# EAGLE design geiger_fixedR5R6 (EAGLE 5.11)
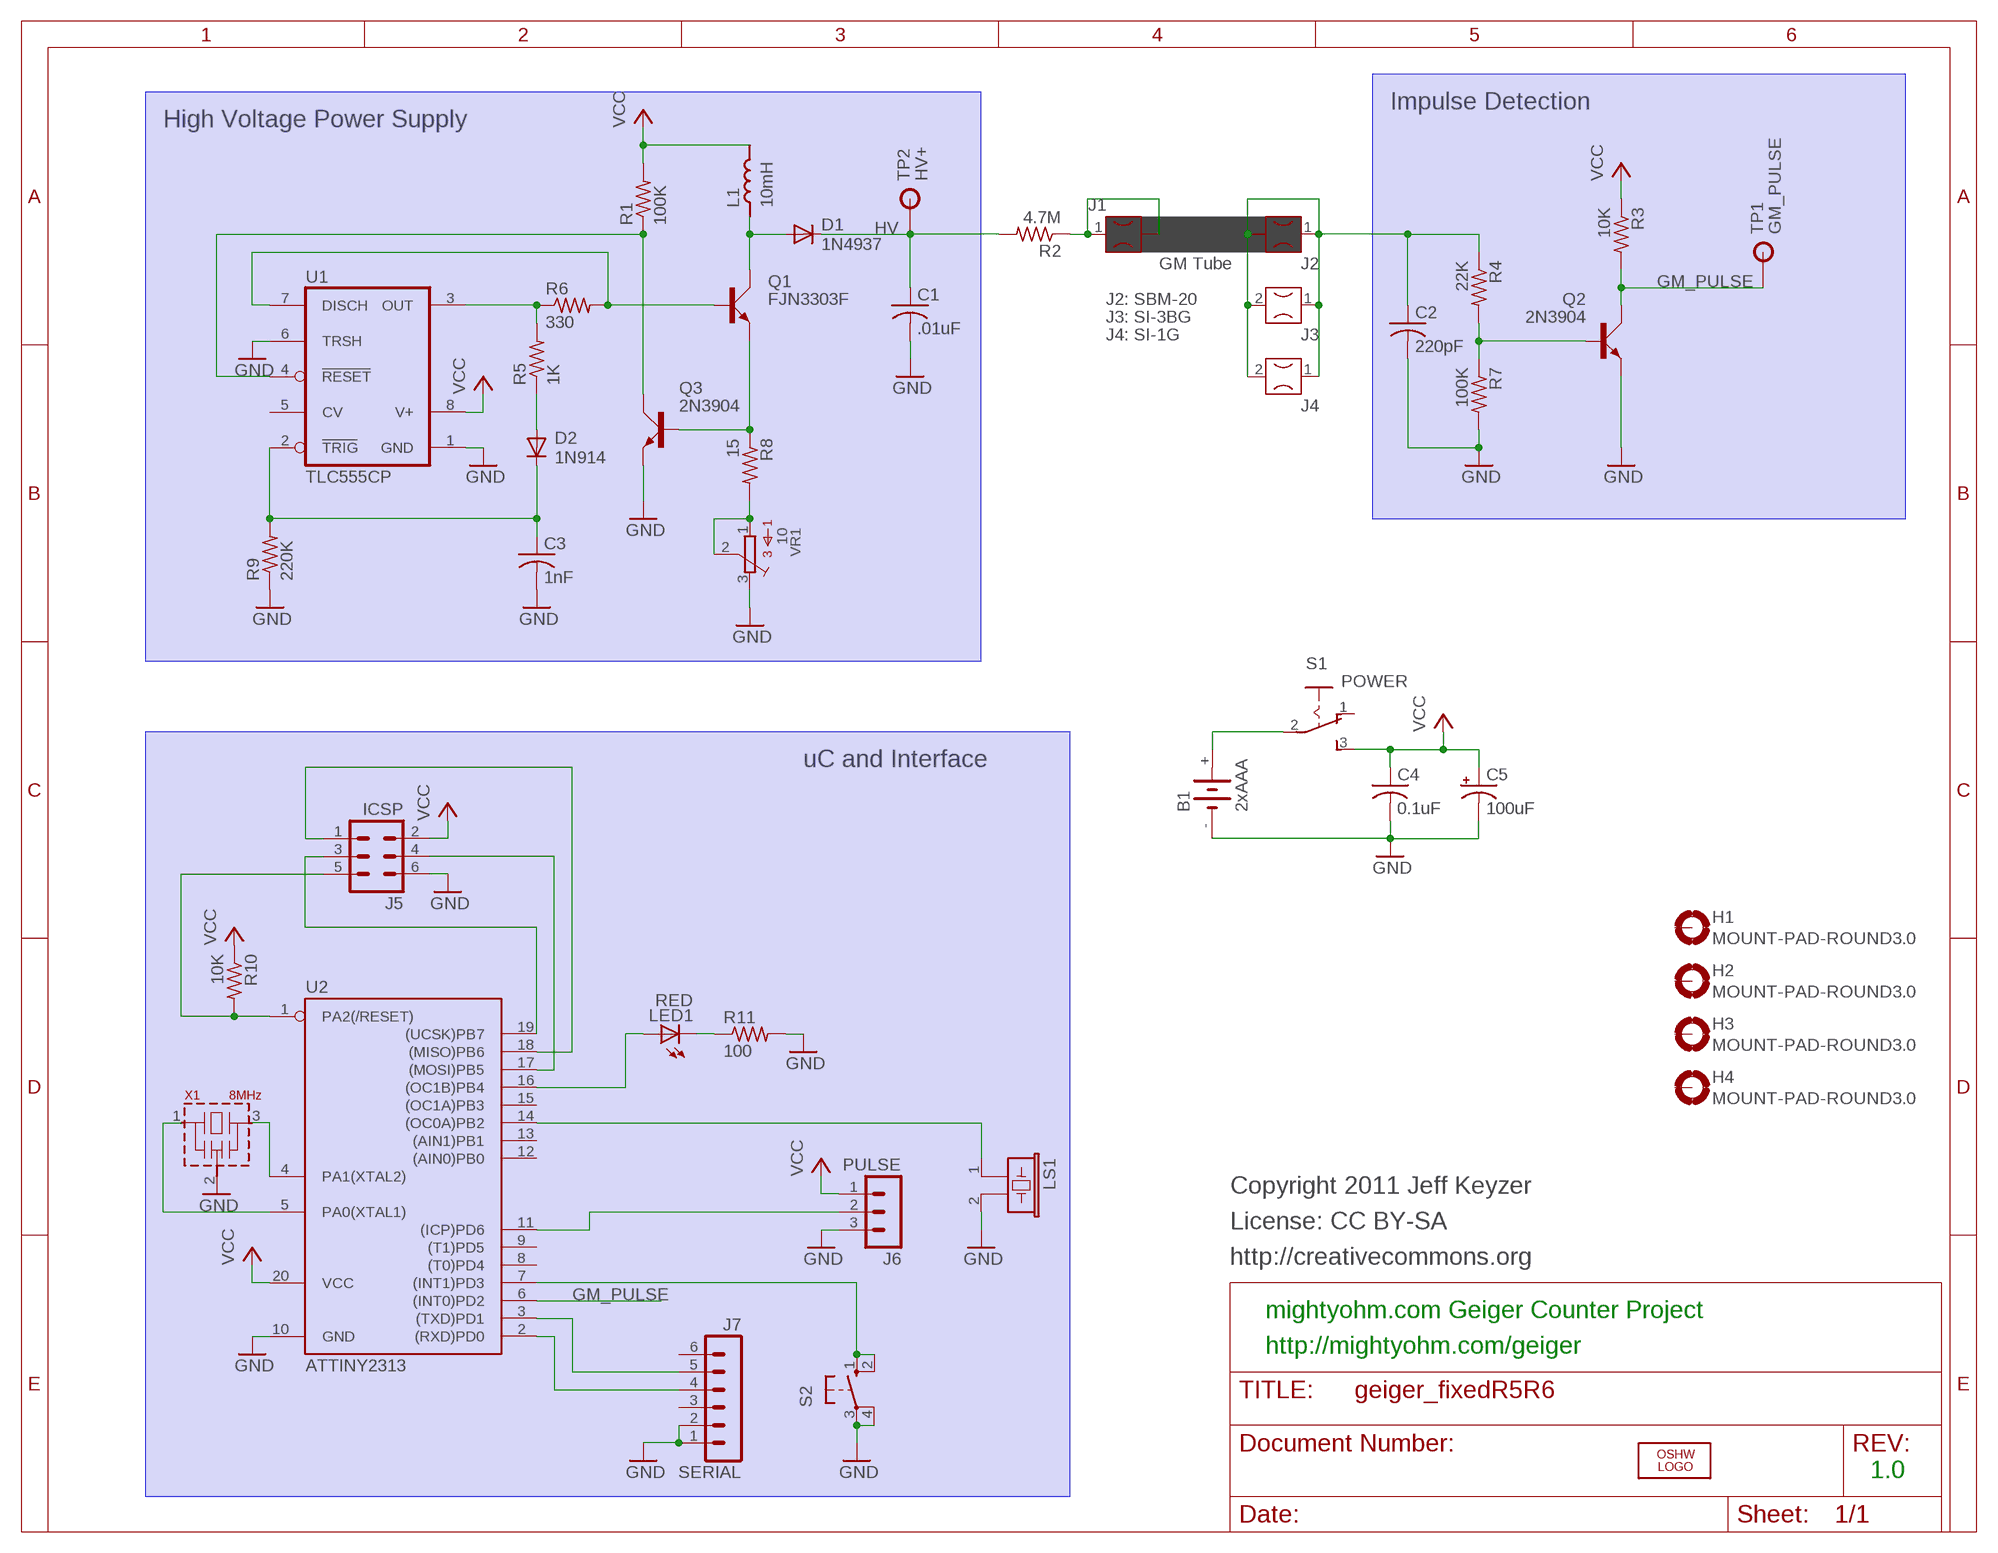
[diagram p0: schematic, sheet 1]

## Parts
B1  2xAAA  BATTERY2XAAA_PCB  [12BH423-GR]
C1  .01uF  C-US102-043X133  [C102-043X133]
C2  220pF  C-US050-030X075  [C050-030X075]
C3  1nF  C-US050-025X075  [C050-025X075]
C4  0.1uF  C-US025-025X050  [C025-025X050]
C5  100uF  CPOL-USE2.5-6  [E2,5-6]
D1  1N4937  1N4933  [DO41-10]
D2  1N914  1N4148DO35-7  [DO35-7]
H1  MOUNT-PAD-ROUND3.0  [3,0-PAD]
H2  MOUNT-PAD-ROUND3.0  [3,0-PAD]
H3  MOUNT-PAD-ROUND3.0  [3,0-PAD]
H4  MOUNT-PAD-ROUND3.0  [3,0-PAD]
J1  FUSECLIPPCMOUNT  [FUSECLIP_PCMOUNT]
J2  FUSECLIPPCMOUNT  [FUSECLIP_PCMOUNT]
J3  FUSECLIPPCMOUNT  [FUSECLIP_PCMOUNT]
J4  FUSECLIPPCMOUNT  [FUSECLIP_PCMOUNT]
J5  ICSP  ICSP-6  [ICSP-6]
J6  PULSE  MA03-1  [MA03-1]
J7  SERIAL  MA06-1  [MA06-1]
L1  10mH  INDELC09D  [ELC09D]
LED1  RED  LED5MM  [LED5MM]
LOGO1  OSHW_LOGO_FILLX0200-NT  [OSHW_FILLX200_NOTEXT]
LS1  PIEZO17MM  [PS1740P02E]
Q1  FJN3303F  2N3704  [TO92C]
Q2  2N3904  [TO92D]
Q3  2N3904  [TO92D]
R1  100K  R-US_0207/10  [0207/10]
R2  4.7M  R-US_0207/10  [0207/10]
R3  10K  R-US_0207/10  [0207/10]
R4  22K  R-US_0207/10  [0207/10]
R5  1K  R-US_0207/10  [0207/10]
R6  330  R-US_0207/10  [0207/10]
R7  100K  R-US_0207/10  [0207/10]
R8  15  R-US_0207/10  [0207/10]
R9  220K  R-US_0207/10  [0207/10]
R10  10K  R-US_0207/10  [0207/10]
R11  100  R-US_0207/10  [0207/10]
S1  POWER  SWITCH_SPDT  [OS102011]
S2  10-XX  [B3F-10XX]
TP1  GM_PULSE  TPPTH  [TP_PTH]
TP2  HV+  TPPTH  [TP_PTH]
U1  TLC555CP  ICM7555  [DIL08]
U2  ATTINY2313  TINY2313-*P*  [DIL20]
VR1  10  3386-P  [3386P]
X1  8MHz  CSTLA_T  [CSTLA_T]

## Nets
GM_PULSE: Q2.C R3.2 TP1.P$1(TP) U2.6((INT0)PD2)
GND: B1.- C1.2 C2.2 C3.2 C4.2 C5.- J5.6 J6.3 J7.1 J7.2 LS1.2 Q2.E Q3.E R7.2 R9.1 R11.2 S2.3(P) S2.4(P1) U1.1(GND) U1.6(TRSH) U2.10(GND) VR1.3 X1.2(VSS)
HV: C1.1 D1.C R2.2 TP2.P$1(TP)
N$1: D2.A R5.1
N$2: S2.1(S) S2.2(S1) U2.7((INT1)PD3)
N$3: Q3.C R1.1 U1.4(RESET)
N$4: LS1.1 U2.14((OC0A)PB2)
N$5: B1.+ S1.2
N$6: J5.4 U2.17((MOSI)PB5)
N$7: J5.3 U2.19((UCSK)PB7)
N$8: Q1.B R6.2 U1.7(DISCH)
N$9: C3.1 D2.C R9.2 U1.2(TRIG)
N$10: R5.2 R6.1 U1.3(OUT)
N$11: Q1.E Q3.B R8.1
N$12: D1.A L1.1 Q1.C
N$13: J5.5 R10.2 U2.1(PA2(/RESET))
N$14: Q2.B R4.2 R7.1
N$15: J1.1 J1.2 R2.1
N$16: J7.4 U2.2((RXD)PD0)
N$17: J7.5 U2.3((TXD)PD1)
N$18: U2.4(PA1(XTAL2)) X1.3
N$19: U2.5(PA0(XTAL1)) X1.1
N$20: J6.2 U2.11((ICP)PD6)
N$21: LED1.K(C) R11.1
N$22: LED1.A U2.16((OC1B)PB4)
N$23: R8.2 VR1.1 VR1.2
N$39: C2.1 J2.1 J2.2 J3.1 J3.2 J4.1 J4.2 R4.1
N$47: J5.1 U2.18((MISO)PB6)
VCC: C4.1 C5.+ J5.2 J6.1 L1.2 R1.2 R3.1 R10.1 S1.3 U1.8(V+) U2.20(VCC)
Unconnected: H1.B3,0(MOUNT) H2.B3,0(MOUNT) H3.B3,0(MOUNT) H4.B3,0(MOUNT) J7.3 J7.6 S1.1 U1.5(CV) U2.8((T0)PD4) U2.9((T1)PD5) U2.12((AIN0)PB0) U2.13((AIN1)PB1) U2.15((OC1A)PB3)

## Notes on the sheet
- Impulse Detection
- High Voltage Power Supply
- GM Tube
- J2: SBM-20
- J3: SI-3BG
- J4: SI-1G
- uC and Interface
- Copyright 2011 Jeff Keyzer
- License: CC BY-SA
- http://creativecommons.org
- mightyohm.com Geiger Counter Project
- http://mightyohm.com/geiger
- 1.0

## Library data of the parts
B1 = mightyohm:BATTERY
C1-C4 = resistor:C-US: CAPACITOR, American symbol
C5 = resistor:CPOL-US: POLARIZED CAPACITOR, American symbol
D1 = diode:1N4933: DIODE fast recovery rectifier, 1A
D2 = diode:1N4148: DIODE high speed (Philips)
H1-H4 = holes:MOUNT-PAD-ROUND: MOUNTING PAD, round
J1-J4 = connectors:FUSECLIP
J5 = connectors:ICSP-6: PIN HEADER
J6 = mightyohm:MA03-1: PIN HEADER; OC_FARNELL: unknown; OC_NEWARK: unknown
J7 = connectors:MA06-1: PIN HEADER
L1 = passives:IND: Inductor
LED1 = mightyohm:LED: MightyOhm Engineering Light Emitting Diodes (LEDs)
LOGO1 = OSHW:OSHW_LOGO_FILL
LS1 = mightyohm:PIEZO; OC_FARNELL: unknown; OC_NEWARK: unknown
Q1 = transistor-small-signal:2N3704: NPN TRANSISTOR
Q2 Q3 = transistor-small-signal:2N3904: NPN TRANSISTOR
R1-R11 = resistor:R-US_: RESISTOR, American symbol
S1 = passives:SWITCH_SPDT
S2 = switch-omron:10-XX: OMRON SWITCH
TP1 TP2 = connectors:TP: Test Point JSK 1/14/11
U1 = maxim:ICM7555: TIMER
U2 = avr-6:TINY2313*: Atmel Tiny2313 2K Flash, 128 bytes EEPROM, 128 bytes RAM
VR1 = BOURNS:3386-: 3386 Series 3/8" Square Trimmer
X1 = murata-resonators:CSTLA_T: Ceramic resonator 10.01 to 13.00 MHz

## Board
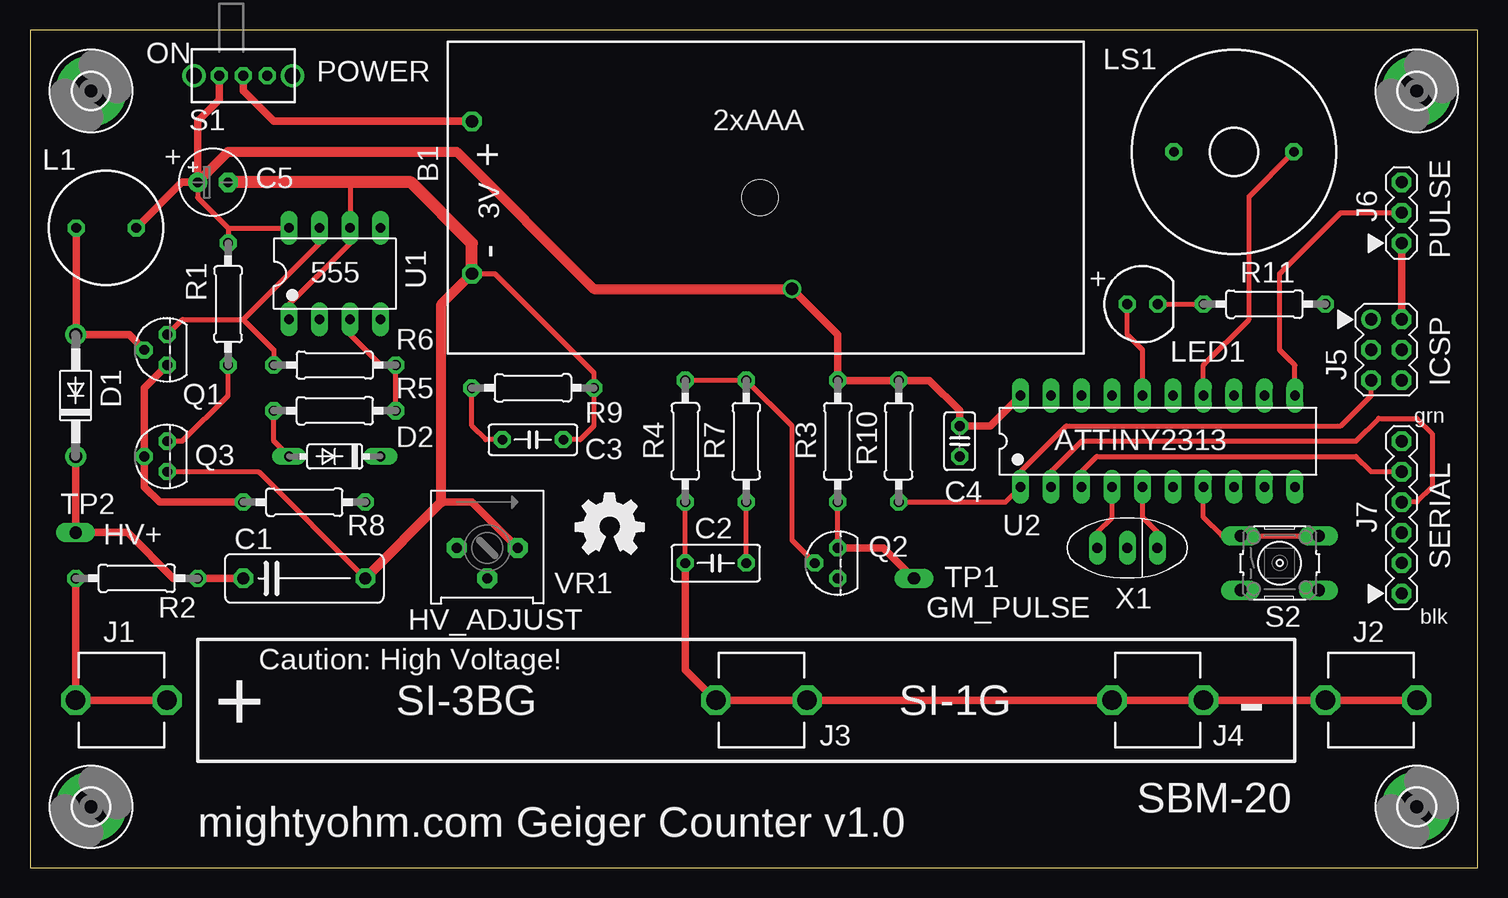
[diagram p1: board, top side]
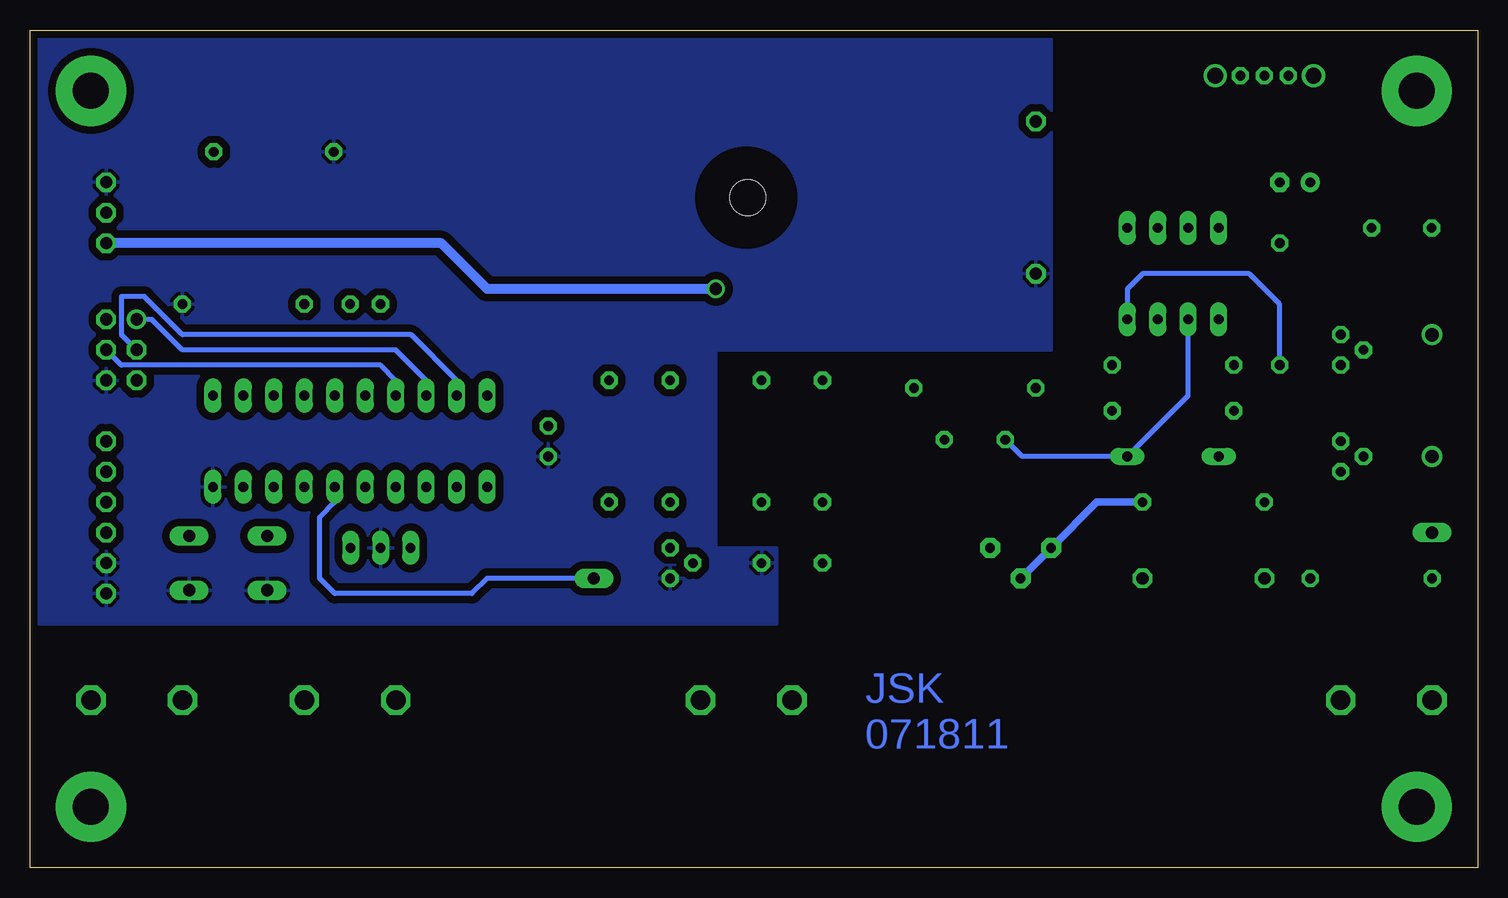
[diagram p2: board, bottom side, seen from below]

Size 120.65 x 69.85 mm. Coordinates in mm from the lower left corner, seen from the top.
Outline: 0,0 120.63,0 120.65,69.85 0,69.85 0,0
Copper layers (1*16): Top 0.035mm / dielectric 1.5mm / Bottom 0.0356mm
Design rules "generic_2l": minimum track width 8mil, minimum drill 20mil, track to track 8mil, track to pad 8mil, pad to pad 8mil, via to via 8mil, smd to smd 0mil, copper to edge 15mil, drill to drill 10mil, minimum pad ring 12mil, minimum via ring 8mil, stop-mask expansion 4mil, vias tented up to drill 25mil, thermal gap 12mil
bRestrict: area 57.4,52.3 to 64.6,59.5

### Footprints (pad centres in the part's own frame; a part is rotated, then mirrored left to right if it is on the bottom)
12BH423-GR = drill 1.016 octagon: + 0,-6.35; - 0,6.35 | hole 3: -24,0
C102-043X133 = drill 1.016 octagon: 1 -5.08,0; 2 5.08,0
C050-030X075 = drill 0.813 octagon: 1 -2.54,0; 2 2.54,0
C050-025X075 = drill 0.813 octagon: 1 -2.54,0; 2 2.54,0
C025-025X050 = drill 0.813 octagon: 1 -1.27,0; 2 1.27,0
E2,5-6 = drill 0.813 pad 1.6 round: + -1.27,0 | drill 0.813 pad 1.6 octagon: - 1.27,0
DO41-10 = drill 1.118 round: A 5.08,0; C -5.08,0
DO35-7 = drill 0.813 long: A 3.81,0; C -3.81,0
3,0-PAD = drill 3 pad 5.842 round: B3,0 0,0
FUSECLIP_PCMOUNT = drill 1.626 octagon: 1 0,0; 2 7.62,0
ICSP-6 = drill 1.016 round: 1 -2.54,-1.27 | drill 1.016 octagon: 2 -2.54,1.27; 3 0,-1.27; 4 0,1.27; 5 2.54,-1.27; 6 2.54,1.27
MA03-1 = drill 1.016 octagon: 1 -2.54,0; 2 0,0; 3 2.54,0
MA06-1 = drill 1.016 octagon: 1 -6.35,0; 2 -3.81,0; 3 -1.27,0; 4 1.27,0; 5 3.81,0; 6 6.35,0
ELC09D = drill 0.813 octagon: 1 -2.5,0; 2 2.5,0
LED5MM = drill 0.813 octagon: A -1.27,0; K 1.27,0
PS1740P02E = drill 0.813 octagon: 1 -5,0; 2 5,0
TO92C = drill 0.813 octagon: B 1.27,0; C 0,1.905; E -1.27,0
TO92D = drill 0.813 octagon: B 0,1.905; C 1.27,0; E -1.27,0
0207/10 = drill 0.813 octagon: 1 -5.08,0; 2 5.08,0
OS102011 = drill 0.813 octagon: 1 -2,0; 2 0,0; 3 2,0 | drill 1.3 round: P$1 -4.1,0; P$2 4.1,0
B3F-10XX = drill 1.016 long: 1 -3.251,2.261; 2 3.251,2.261; 3 -3.251,-2.261; 4 3.251,-2.261
TP_PTH = drill 1.016 long: P$1 0,0
DIL08 = drill 0.813 long: 1 -3.81,-3.81; 2 -1.27,-3.81; 3 1.27,-3.81; 4 3.81,-3.81; 5 3.81,3.81; 6 1.27,3.81; 7 -1.27,3.81; 8 -3.81,3.81
DIL20 = drill 0.813 long: 1 -11.43,-3.81; 2 -8.89,-3.81; 3 -6.35,-3.81; 4 -3.81,-3.81; 5 -1.27,-3.81; 6 1.27,-3.81; 7 3.81,-3.81; 8 6.35,-3.81; 9 8.89,-3.81; 10 11.43,-3.81; 11 11.43,3.81; 12 8.89,3.81; 13 6.35,3.81; 14 3.81,3.81; 15 1.27,3.81; 16 -1.27,3.81; 17 -3.81,3.81; 18 -6.35,3.81; 19 -8.89,3.81; 20 -11.43,3.81
3386P = drill 0.813 pad 1.676 octagon: 1 -2.54,0; 2 0,-2.54; 3 2.54,0
CSTLA_T = drill 0.813 long: 1 -2.5,0; 2 0,0; 3 2.5,0

### Placement (x,y rotation side)
B1  36.83,55.88 180 top
C1  22.86,24.13 0 top
C2  57.15,25.4 0 top
C3  41.91,35.69 0 top
C4  77.47,35.56 270 top
C5  15.24,57.15 0 top
D1  3.81,39.37 90 top
D2  25.4,34.29 180 top
H1  115.57,5.08 0 top
H2  115.57,64.77 0 top
H3  5.08,5.08 0 top
H4  5.08,64.77 0 top
J1  3.81,13.97 0 top
J2  107.95,13.97 0 top
J3  57.15,13.97 0 top
J4  90.17,13.97 0 top
J5  113.03,43.18 270 top
J6  114.3,54.61 90 top
J7  114.3,29.21 90 top
L1  6.35,53.34 0 top
LED1  92.71,46.99 0 top
LOGO1  45.47,26.16 0 top
LS1  100.33,59.69 180 top
Q1  11.43,43.18 90 top
Q2  67.31,25.4 90 top
Q3  11.43,34.29 90 top
R1  16.51,46.99 90 top
R2  8.89,24.13 0 top
R3  67.31,35.56 270 top
R4  54.61,35.56 90 top
R5  25.4,38.1 0 top
R6  25.4,41.91 180 top
R7  59.69,35.56 270 top
R8  22.86,30.48 0 top
R9  41.91,40.01 180 top
R10  72.39,35.56 270 top
R11  102.87,46.99 0 top
S1  17.78,66.04 180 top
S2  104.14,25.4 0 top
TP1  73.66,24.13 0 top
TP2  3.81,27.94 0 top
U1  25.4,49.53 0 top
U2  93.98,35.56 0 top
VR1  38.1,26.67 0 top
X1  91.44,26.67 180 top

### Tracks (layer width: path | path; a pad name or v marks a point on that pad's centre or on a via)
GM_PULSE
  Top 0.406: Q2.C R3.2
  Top 0.61: TP1.P$1 71.12,26.67 Q2.C
  Bottom 0.406: TP1.P$1 82.55,24.13 83.82,22.86 95.25,22.86 96.52,24.13 96.52,29.21 95.25,30.48 U2.6
GND
  Top 0.406: C2.2 R7.2 | U1.1 21.59,46.99 26.67,52.07 U1.6 26.67,57.15 | Q3.E 19.05,33.02 C1.2 | C3.2 45.85,35.69 46.99,36.83 R9.1 46.99,41.27 38.73,49.53 B1.-
  Top 0.61: 34.29,30.48 36.83,30.48 VR1.3
  Top 0.813: B1.- 34.29,46.99 34.29,30.48 C1.2
  Top 1.016: C5.- 26.67,57.15 31.75,57.15 36.83,52.07 B1.-
  Bottom 0.305: U2.10 105.41,33.02
  pour Bottom (isolate 0.635): 120.65,69.85 35.56,69.85 35.56,43.18 63.5,43.18 63.5,26.67 58.42,26.67 58.42,20.32 120.65,20.32
HV
  Top 0.61: D1.C TP2.P$1 8.13,27.94 11.94,24.13 R2.2 C1.1
N$1
  Top 0.406: D2.A 20.32,35.56 R5.1
N$2
  Top 0.406: S2.2 S2.1 99.34,27.66 97.79,29.21 U2.7
N$3
  Top 0.406: R1.1 16.51,39.37 12.7,35.56 Q3.C
  Bottom 0.406: U1.4 29.21,48.26 27.94,49.53 19.05,49.53 16.51,46.99 R1.1
N$4
  Top 0.406: U2.14 97.79,41.91 101.6,45.72 101.6,55.96 LS1.1
N$5
  Top 0.61: S1.2 17.78,64.77 20.32,62.23 B1.+
N$6
  Bottom 0.406: J5.4 113.03,41.91 91.44,41.91 90.17,40.64 U2.17
N$7
  Bottom 0.406: U2.19 85.09,40.64 88.9,44.45 107.95,44.45 111.12,47.62 113.03,47.62 113.03,44.45 J5.3
N$8
  Top 0.406: U1.7 24.13,52.07 17.78,45.72 | 17.78,45.72 20.32,43.18 R6.2 | Q1.B 12.7,45.72 17.78,45.72
N$9
  Top 0.406: C3.1 37.97,35.69 36.83,36.83 R9.2
  Bottom 0.406: U1.2 24.13,39.37 D2.C 37.97,34.29 C3.1
N$10
  Top 0.406: R5.2 R6.1 29.21,41.91 26.67,44.45 U1.3
N$11
  Top 0.61: Q1.E 9.53,40.01 Q3.B 9.53,31.75 10.79,30.48 R8.1
N$12
  Top 0.406: D1.A 3.85,44.49
  Top 0.61: 3.85,44.49 L1.1 | D1.A 8.26,44.45 Q1.C
N$13
  Top 0.305: U2.1 82.55,33.02
  Top 0.406: R10.2 81.28,30.48 U2.1 | 82.55,33.02 86.36,36.83 109.22,36.83 111.76,39.37 J5.5
N$14
  Top 0.406: R4.2 R7.1 63.5,36.83 63.5,27.3 Q2.B
N$15
  Top 0.61: J1.2 J1.1 R2.1
N$16
  Top 0.406: U2.2 85.09,33.02 87.63,35.56 110.49,35.56 112.39,37.47 115.57,37.47 116.84,36.2 116.84,31.75 115.57,30.48 J7.4
N$17
  Top 0.406: U2.3 87.63,33.02 88.9,34.29 110.49,34.29 111.76,33.02 J7.5
N$18
  Top 0.406: U2.4 90.17,29.21 88.9,27.94 88.9,26.71 X1.3
N$19
  Top 0.305: X1.1 93.98,26.71
  Top 0.406: U2.5 92.71,29.21 93.98,27.94 93.98,26.71
N$20
  Top 0.406: U2.11 105.41,41.91 104.14,43.18 104.14,49.53 109.22,54.61 J6.2
N$21
  Top 0.406: LED1.K R11.1
N$22
  Top 0.406: U2.16 92.71,43.18 91.44,44.45 LED1.A
N$23
  Bottom 0.61: R8.2 31.75,30.48 VR1.1 VR1.2
N$39
  Top 0.406: C2.1 R4.1
  Top 0.61: J2.2 J2.1 J4.2 J4.1 J3.2 J3.1 54.61,16.51 C2.1
N$47
  Bottom 0.305: U2.18 87.63,40.64
  Bottom 0.406: 87.63,40.64 90.17,43.18 107.95,43.18 110.49,45.72 J5.1
VCC  (via drill 1.02)
  Top 0.406: 16.51,53.34 R1.2 | 16.51,53.34 13.97,55.88 C5.+ | 16.51,53.34 U1.8
  Top 0.61: U2.20 80.01,36.83 C4.1 77.47,38.1 74.93,40.64 R10.1 R3.1 67.31,44.45 v63.5,48.26 | J6.1 J5.2 | S1.3 15.78,64.04 13.97,62.23 C5.+ 12.66,57.15 L1.2
  Top 0.813: v63.5,48.26 46.99,48.26 35.56,59.69 16.51,59.69 C5.+
  Bottom 0.305: U2.20 82.55,40.64
  Bottom 0.813: J6.1 86.36,52.07 82.55,48.26 v63.5,48.26

### Text on the board
Bottom: JSK | 071811
tPlace: ON | + | 3V | 555 | grn | HV_ADJUST | blk | Caution: High Voltage! | SI-3BG | SI-1G | + | - | SBM-20 | mightyohm.com Geiger Counter v1.0